# EAGLE design io (EAGLE 9.6.2)
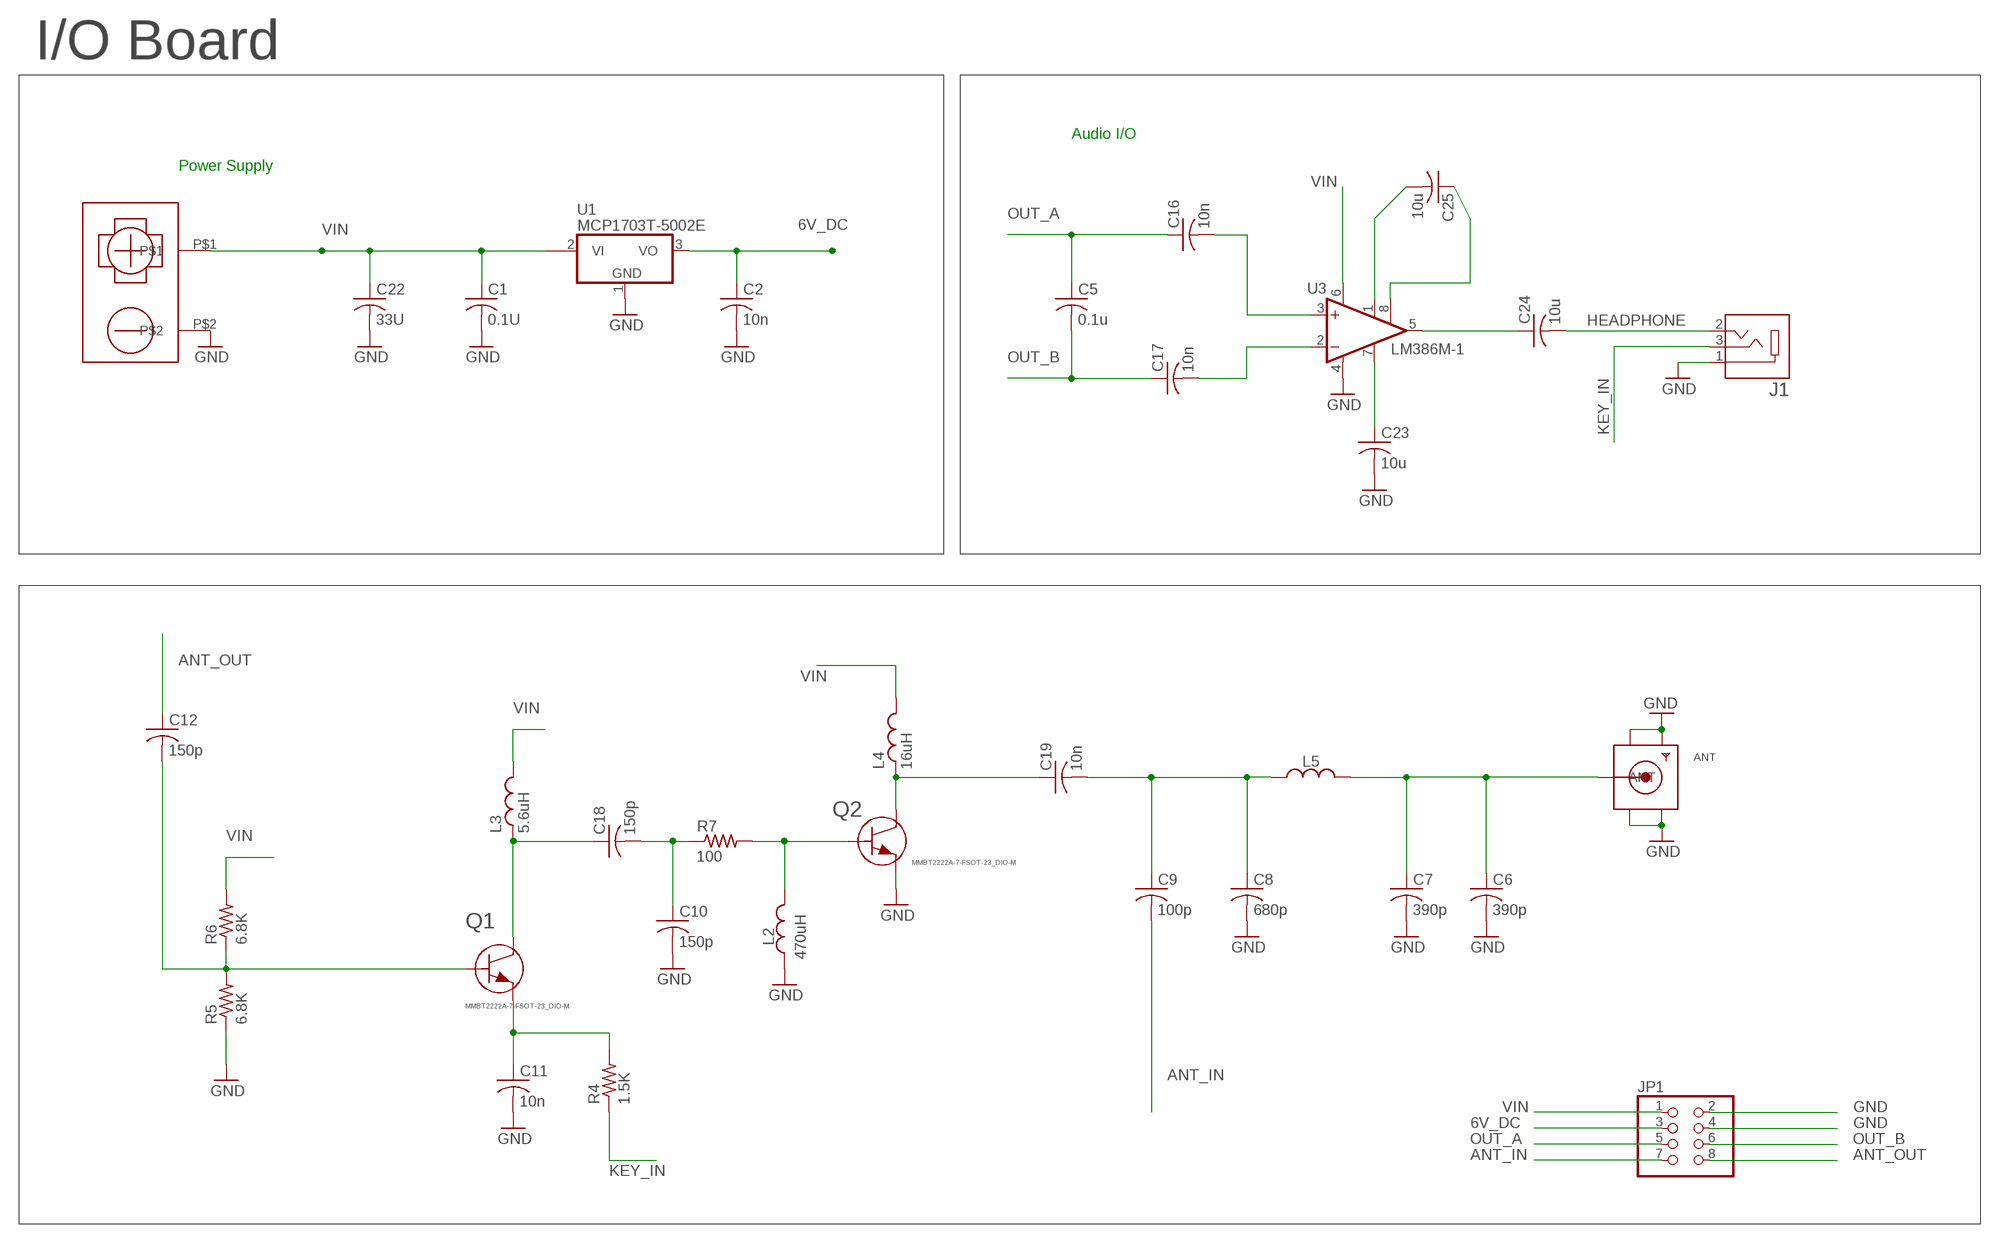
[diagram p0: schematic, sheet 1]

## Parts
ANT  SMACONNECTOR_EDGE  [SMA_EDGELAUNCH]
C1  0.1U  C-USC0805  [C0805]
C2  10n  C-USC0805  [C0805]
C5  0.1u  C-USC0805  [C0805]
C6  390p  C-USC0805  [C0805]
C7  390p  C-USC0805  [C0805]
C8  680p  C-USC0805  [C0805]
C9  100p  C-USC0805  [C0805]
C10  150p  C-USC0805  [C0805]
C11  10n  C-USC0805  [C0805]
C12  150p  C-USC0805  [C0805]
C16  10n  C-USC0805  [C0805]
C17  10n  C-USC0805  [C0805]
C18  150p  C-USC0805  [C0805]
C19  10n  C-USC1206  [C1206]
C22  33U  C-USC1206  [C1206]
C23  10u  C-USC0805  [C0805]
C24  10u  C-USC0805  [C0805]
C25  10u  C-USC0805  [C0805]
J1  SJ-3523-SMT-TR  [CUI_SJ-3523-SMT-TR]
JP1  PINHD-2X4  [2X04]
L2  470uH  L_CHIP-1008(2520-METRIC)  [INDC2520X120N]
L3  5.6uH  SRP3012C-5R6M  [SRP3012C]
L4  16uH  ASPI-0630LR  [ASPI-0630LR]
L5  1.2uH  SRN4018TA-1R2M  [SRN4018TA]
Q1  MMBT2222A-7-FSOT-23_DIO-M  [SOT-23_DIO-M]
Q2  MMBT2222A-7-FSOT-23_DIO-M  [SOT-23_DIO-M]
R4  1.5K  R-US_M0805  [M0805]
R5  6.8K  R-US_M0805  [M0805]
R6  6.8K  R-US_M0805  [M0805]
R7  100  R-US_M0805  [M0805]
U1  MCP1703T-5002E  MCP170312MB  [SOT89]
U3  LM386M-1  [SO08]
U$1  9V_9689V_968_SMD  [9V_968_PAD]

## Nets
6V_DC [power]: C2.1 JP1.3 U1.3(VO)
ANT_IN: C9.2 JP1.7
ANT_OUT: C12.1 JP1.8
GND: ANT.GND@1(GND4) ANT.GND@3(GND2) C1.2 C2.2 C6.2 C7.2 C8.2 C10.2 C11.2 C22.2 C23.2 J1.1 JP1.2 JP1.4 L2.1 R5.1 U1.1(GND) U3.4(GND) U$1.P$2
HEADPHONE: C24.2 J1.2
KEY_IN: J1.3 R4.1
N$1: ANT.GND@2(GND3)
N$2: ANT.GND@4(GND1)
N$9: C16.2 U3.3(+IN)
N$10: C17.2 U3.2(-IN)
N$11: C23.1 U3.7(BYPASS)
N$12: C25.1 U3.8(GAIN)
N$13: C25.2 U3.1(GAIN)
N$14: C24.1 U3.5(OUT)
N$19 [power]: C12.2 Q1.1 R5.2 R6.1
N$20 [power]: C11.1 Q1.2 R4.2
N$21 [power]: C18.1 L3.P$1 Q1.3
N$22 [power]: C10.1 C18.2 R7.1
N$23 [power]: L2.2 Q2.1 R7.2
N$24 [power]: C19.1 L4.P$1 Q2.3
N$25 [power]: C8.1 C9.1 C19.2 L5.P$1
N$26 [power]: ANT.P(ANT) C6.1 C7.1 L5.P$2
N$29 [power]: Q2.2 ; supply symbol labelled GND
OUT_A: C5.1 C16.1 JP1.5
OUT_B: C5.2 C17.1 JP1.6
VIN [power]: C1.1 C22.1 JP1.1 L3.P$2 L4.P$2 R6.2 U1.2@1(VI1) U3.6(VS) U$1.P$1
Unconnected: U1.2(VI)

## Notes on the sheet
- I/O Board
- Audio I/O
- Power Supply

## Library data of the parts
ANT = zort2:SMACONNECTOR: SMA Connector 90° DIP SMA Connector, 50 Ohm (4UConnector: 07259)
C1 C2 C5-C12 C16-C19 C22-C25 = adafruit:C-US: CAPACITOR, American symbol
J1 = SJ-3523-SMT-TR:SJ-3523-SMT-TR: Audio Jack Connector 3.5 mm Low Profile Surface Mount Stereo Jack, 3 Pin Right-Angle; MF: CUI Inc; STANDARD: Manufacturer recommendations
JP1 = adafruit:PINHD-2X4: PIN HEADER
L2 = zort2:L: Inductor Fixed - Generic; CATEGORY: Inductor; SUB-CATEGORY: Fixed
L3 = zort2:SRP3012C-5R6M: SRP3012C-5R6M SMD 1.5A 15uH inductor with a flat square package. DigiKey Link <https://www.digikey.com/en/products/detail/bourns-inc/SRP3012C-5R6M/11633310>.
L4 = zort2:ASPI-0630LR: ASPI-0630LR SMD inductors with flat square cases DigiKey Link <https://www.digikey.com/en/products/detail/abracon-llc/ASPI-0630LR-150M-T15/3059603>
L5 = zort2:SRN4018TA-1R2M: SRN4018TA-1R2M 1.2uH 3A inductor
Q1 Q2 = zort2:MMBT2222A-7-F; BUILT_BY: EMA_UL_Team; MANUFACTURER_PART_NUMBER: MMBT2222A-7-F; SOURCELIBRARY: DIODESINC_2_2015-08-18; VENDOR: Diodes Inc
R4-R7 = adafruit:R-US_: RESISTOR, American symbol
U1 = linear:MCP1703*: 250 mA, 16V, Low Quiescent Current LDO Regulator Source: http://ww1.microchip.com/downloads/en/DeviceDoc/22049b.pdf
U3 = linear:LM386?-*: Low Voltage Audio Power Amplifier Source: http://cache.national.com/ds/LM/LM386.pdf
U$1 = zort2:9V_968: Keystone 968, 9V connector pad. https://www.digikey.com/product-detail/en/keystone-electronics/968/36-968-ND/151577

## Net classes
1 power: width 0.381 mm

## Board
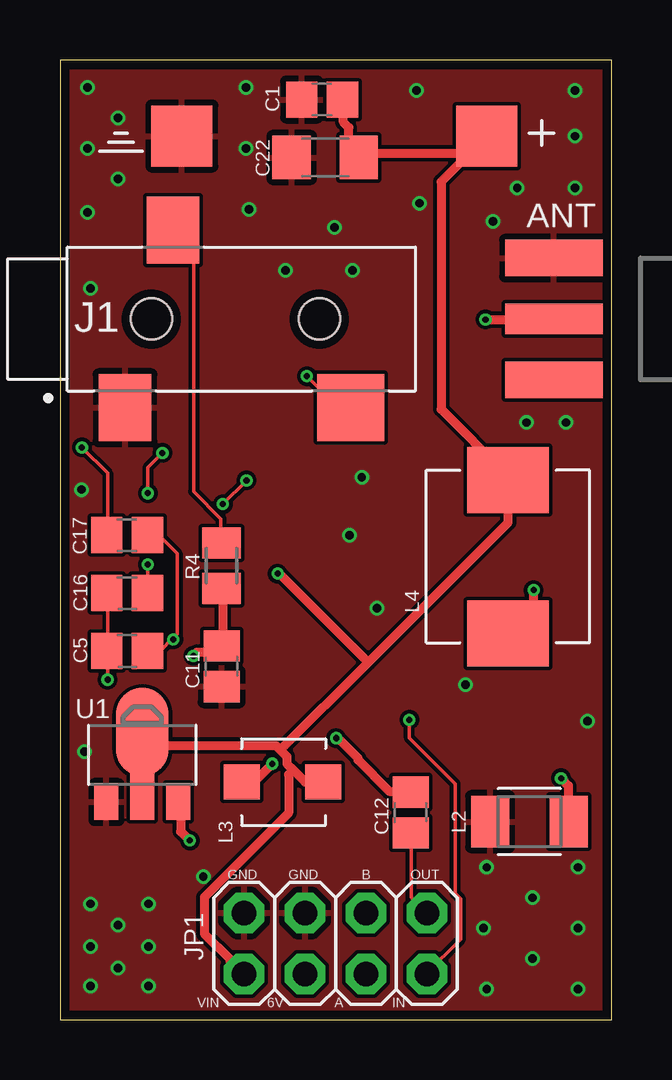
[diagram p1: board, top side]
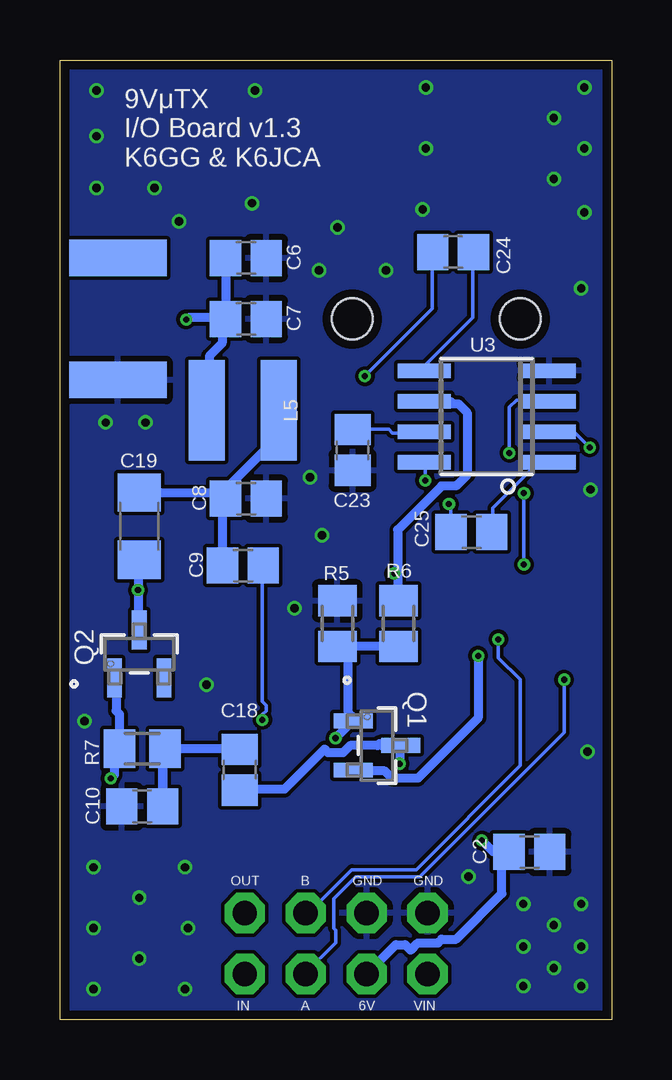
[diagram p2: board, bottom side, seen from below]

Size 22.99 x 40.01 mm. Coordinates in mm from the lower left corner, seen from the top.
Outline: 0,0 22.99,0 22.99,40.01 0,40.01 0,0
Copper layers (1*16): Top 0.035559375mm / dielectric 1.6mm / Bottom 0.035559375mm
Design rules "oshpark-2layer": minimum track width 6mil, minimum drill 10mil, track to track 6mil, track to pad 6mil, pad to pad 6mil, via to via 6mil, smd to smd 6mil, copper to edge 15mil, drill to drill 6mil, minimum pad ring 5mil, minimum via ring 5mil, stop-mask expansion 2.5mil, vias tented up to drill 0mil, thermal gap 10mil

### Footprints (pad centres in the part's own frame; a part is rotated, then mirrored left to right if it is on the bottom)
SMA_EDGELAUNCH = smd 4.064 x 1.524: GND@1 2.032,-2.54; GND@2 2.032,2.54 | smd 4.064 x 1.524 bottom: GND@3 2.032,2.54; GND@4 2.032,-2.54 | smd 4.064 x 1.27: P 2.032,0
C0805 = smd 1.3 x 1.5: 1 -0.85,0; 2 0.85,0
C1206 = smd 1.6 x 1.8: 1 -1.4,0; 2 1.4,0
CUI_SJ-3523-SMT-TR = smd 2.2 x 2.8: 1 -1.1,-3.7; 3 0.9,3.7 | smd 2.8 x 2.8: 2 8.3,-3.7 | hole 1.7: 0,0; 7,0
2X04 = drill 1.016 pad 1.676 octagon: 1 -3.81,-1.27; 2 -3.81,1.27; 3 -1.27,-1.27; 4 -1.27,1.27; 5 1.27,-1.27; 6 1.27,1.27; 7 3.81,-1.27; 8 3.81,1.27
INDC2520X120N = smd 1.587 x 2.129: 1 -1.633,0; 2 1.633,0
SRP3012C = smd 1.5 x 1.45: P$1 -1.7,0; P$2 1.7,0
ASPI-0630LR = smd 2.75 x 3.4: P$1 -3.2,0; P$2 3.2,0
SRN4018TA = smd 1.5 x 4.2: P$1 -1.5,0; P$2 1.5,0
SOT-23_DIO-M = smd 0.612 x 1.626: 1 -1.025,-0.996; 2 1.025,-0.996; 3 0,0.996
M0805 = smd 1.3 x 1.6: 1 -0.95,0; 2 0.95,0
SOT89 = smd 1 x 1.5: 1 -1.499,-1.981; 3 1.499,-1.981 | smd 1 x 2: 2 0,-1.727 | smd 2.2 x 3.7: 2@1 0,0.94
SO08 = smd 0.6 x 2.2: 1 -1.905,-2.6; 2 -0.635,-2.6; 3 0.635,-2.6; 4 1.905,-2.6; 5 1.905,2.6; 6 0.635,2.6; 7 -0.635,2.6; 8 -1.905,2.6
9V_968_PAD = smd 2.54 x 2.54: P$1 0,6.35; P$2 0,-6.35

### Placement (x,y rotation side)
ANT  22.61,29.21 180 top
C1  10.92,38.35 180 top
C2  3.43,6.99 0 bottom
C5  2.79,15.37 0 top
C6  15.24,31.75 0 bottom
C7  15.24,29.21 0 bottom
C8  15.24,21.72 0 bottom
C9  15.37,18.92 0 bottom
C10  19.56,8.89 180 bottom
C11  6.73,14.73 270 top
C12  14.61,8.64 90 top
C16  2.79,17.78 0 top
C17  2.79,20.19 180 top
C18  15.49,10.41 90 bottom
C19  19.68,20.57 90 bottom
C22  11.05,35.94 180 top
C23  10.79,23.75 270 bottom
C24  6.6,32 180 bottom
C25  5.84,20.32 0 bottom
J1  3.81,29.21 0 top
JP1  11.48,3.17 0 top
L2  19.56,8.26 0 top
L3  9.27,9.91 0 top
L4  18.67,19.3 90 top
L5  15.37,25.4 180 bottom
Q1  9.78,11.43 270 bottom
Q2  19.68,15.24 0 bottom
R4  6.73,18.92 270 top
R5  11.43,16.51 270 bottom
R6  8.89,16.51 90 bottom
R7  19.56,11.3 180 bottom
U1  3.43,11.05 0 top
U3  5.21,25.15 90 bottom
U$1  11.43,36.83 270 top

### Tracks (layer width: path | path; a pad name or v marks a point on that pad's centre or on a via)
6V_DC  (via drill 0.25)
  Top 0.381: 4.88,8.76 4.88,9.07 U1.3 4.95,8.69 5.03,8.61 5.03,7.85 v5.41,7.47
  Bottom 0.381: v5.41,7.47 4.95,7.01 4.34,7.01 C2.1 4.57,6.86 4.57,5.26 6.48,3.35 7.09,3.35 7.24,3.2 8.08,3.2 8.38,2.9 8.61,3.12 8.99,3.12 JP1.3
ANT_IN  (via drill 0.25)
  Top 0.152: v14.55,12.5 14.55,11.73 16.46,9.83 16.46,5.26 16.69,5.03 16.69,3.35 15.24,1.91 JP1.7
  Bottom 0.152: 15.24,1.91 JP1.7 | v14.55,12.5 14.55,12.72 14.4,12.88 14.4,13.11 14.55,13.26 14.55,18.9 C9.2
ANT_OUT
  Top 0.152: JP1.8 14.63,5.11 14.63,7.77 C12.1
GND  (via drill 0.35)
  other vias: 1.14,38.86 7.75,38.86 1.14,36.32 7.75,36.32 14.86,38.73 21.46,38.73 21.46,34.67 1.27,4.83 3.68,4.83 1.27,1.4 3.68,1.4 17.78,6.35 21.59,6.35 17.78,1.27 21.59,1.27 12.06,20.19 13.21,17.14 16.89,13.97 21.97,12.45 1.27,30.48 11.43,33.02 1.02,11.18 0.89,22.1 5.97,5.97 18.03,33.27 19.43,24.89 21.08,24.89 1.14,33.66 7.87,33.78 14.99,34.04 21.46,36.83 19.05,34.67 12.57,22.61 2.41,3.94 1.27,3.05 2.41,2.16 3.68,3.05 19.68,5.08 17.65,3.81 19.68,2.54 21.59,3.81 2.41,37.59 2.41,35.05 9.4,31.24 12.19,31.24
  pour Top: 0.38,39.75 0.38,0.38 22.73,0.38 22.73,39.62 22.73,39.75
  pour Bottom: 0.38,39.62 0.38,0.38 22.61,0.38 22.61,39.62
HEADPHONE  (via drill 0.25)
  Top 0.152: v10.29,26.82 11.58,25.53 12.04,25.53 J1.2
  Bottom 0.152: v10.29,26.82 7.47,29.64 7.47,32 C24.2
KEY_IN
  Top 0.152: R4.1 6.71,19.89 6.71,20.88 5.56,22.02 5.56,32 4.72,32.84 J1.3
N$9  (via drill 0.25)
  Top 0.152: v3.66,18.97 3.66,17.83 C16.2 | v3.66,21.95 3.66,23.01 v4.27,23.62
  Bottom 0.152: v3.66,21.95 v3.66,18.97 | v4.27,23.62 4.27,25.53 3.96,25.83 2.67,25.83 U3.3
N$10  (via drill 0.25)
  Top 0.152: v0.91,23.85 1.98,22.78 1.98,20.19 C17.2
  Bottom 0.152: v0.91,23.85 1.52,24.46 2.59,24.46 U3.2
N$11
  Bottom 0.152: C23.1 10.74,24.61 9.3,24.61 9.14,24.46 7.85,24.46 U3.7
N$12  (via drill 0.25)
  Top 0.152: v7.77,22.48 v6.78,21.49
  Bottom 0.152: 7.7,23.16 7.77,23.24 U3.8 7.77,23.16 v7.77,22.48 | 6.71,20.34 C25.1 6.71,20.42 6.71,21.41 v6.78,21.49
N$13
  Bottom 0.152: U3.1 3.05,23.24 4.95,21.34 4.95,20.34 C25.2
N$14
  Bottom 0.152: C24.1 5.79,32 5.79,29.26 7.85,27.2 7.85,27.05 U3.5
N$19  (via drill 0.25)
  Top 0.381: v11.51,11.73 11.58,11.73 12.42,10.9 12.42,10.82 13.72,9.53 14.55,9.53 C12.2
  Bottom 0.381: v11.51,11.73 10.82,12.42 Q1.1 10.82,12.65 10.97,12.8 10.97,15.39 10.9,15.54 R5.2 R6.1
N$20  (via drill 0.25)
  Top 0.381: R4.2 6.78,17.91 6.78,15.62 C11.1 6.55,15.54 6.33,15.32 5.71,15.32 v5.56,15.16
  Bottom 0.381: v5.56,15.16 5.56,12.57 8.08,10.06 9.14,10.06 9.45,10.36 10.74,10.36 Q1.2
N$21  (via drill 0.25)
  Top 0.381: 7.44,10.03 L3.P$1 7.7,9.98 8.15,9.98 v8.84,10.67
  Bottom 0.381: C18.1 15.47,9.6 13.64,9.6 11.96,11.28 11.81,11.12 11.2,11.12 10.9,11.43 9.75,11.43 9.68,11.51 9.6,11.43 Q1.3 8.84,11.28 v8.84,10.67
N$22
  Bottom 0.381: 18.52,11.28 15.54,11.28 C18.2 | 18.59,11.28 18.71,11.16 C10.1 18.71,11.2 R7.1
  Bottom 0.762: 18.59,11.28 18.52,11.28
N$23  (via drill 0.25)
  Top 0.381: v20.88,10.06 21.18,9.75 21.18,8.31 L2.2
  Bottom 0.381: 20.5,11.51 20.5,12.72 20.65,12.88 20.65,14.17 Q2.1 | v20.88,10.06 20.73,10.21 20.73,10.97 20.57,11.12 20.57,11.24 R7.2 20.5,11.31
  Bottom 0.762: 20.5,11.31 20.5,11.51
N$24  (via drill 0.25)
  Top 0.381: v19.74,17.91 19.74,17.22 18.67,16.15 L4.P$1
  Bottom 0.381: Q2.3 19.74,16.31 v19.74,17.91 19.74,19.13 C19.1
N$25
  Bottom 0.381: 19.66,21.95 C19.2 19.51,21.95 16.46,21.95 16.28,21.77 C8.1 | C9.1 16.23,18.97 16.23,21.49 16.09,21.58 C8.1 | C8.1 16.09,21.97 16.16,22.04 13.87,24.33 13.87,25.38 L5.P$1
N$26  (via drill 0.25)
  Top 0.381: v17.73,29.18 20.57,29.18 ANT.P
  Bottom 0.381: C7.1 16.08,29.26 16.08,31.7 C6.1 | 16.15,29.03 C7.1 | 16.84,25.45 L5.P$2 16.76,25.6 16.76,27.66 16.23,28.19 16.23,28.88 C7.1 | v17.73,29.18 17.65,29.26 16.23,29.26 C7.1
OUT_A  (via drill 0.25)
  Top 0.152: C16.1 1.98,17.75 1.98,15.39 C5.1 1.98,15.32 v1.98,14.17
  Bottom 0.152: v1.98,14.17 1.98,11.96 8,5.94 10.67,5.94 11.58,5.03 11.58,3.81 11.51,3.73 11.51,3.2 12.8,1.91 JP1.5
OUT_B  (via drill 0.25)
  Top 0.152: 4.69,15.89 4.88,16.08 4.88,19.43 4.12,20.19 C17.1 | 4.69,15.89 4.19,15.39 3.66,15.39 C5.2 | v4.72,15.85 4.69,15.89
  Bottom 0.152: v4.72,15.85 4.72,15.09 3.81,14.17 3.81,10.59 8.15,6.25 10.82,6.25 12.57,4.5 12.72,4.5 JP1.6
VIN  (via drill 0.25)
  Top 0.381: C1.1 11.81,38.33 11.81,37.41 12.04,37.19 12.04,36.35 12.42,35.97 C22.1 12.5,36.12 16.54,36.12 U$1.P$1 15.88,34.92 15.88,25.45 18.59,22.73 | L3.P$2 10.21,9.91 9.72,10.4 | 9.72,10.4 9.45,10.67 9.45,10.97 9.18,11.24 | 9.18,11.24 8.99,11.43 3.96,11.43 3.43,11.96 U1.2@1 | JP1.1 7.62,1.91 7.09,2.44 7.09,2.52 6.02,3.58 6.02,5.11 9.53,8.61 9.53,10.21 9.72,10.4 | 9.18,11.24 12.84,14.9 | 12.84,14.9 18.67,20.73 L4.P$2 18.59,22.63 18.59,22.73 | 18.59,22.73 18.59,23.01 | v9.07,18.59 9.14,18.59 12.84,14.9
  Top 0.762: 16.89,35.94 U$1.P$1
  Bottom 0.381: 7.77,25.83 U3.6 7.7,25.76 6.71,25.76 6.63,25.68 6.4,25.68 6.02,25.3 6.02,22.71 6.48,22.25 7.09,22.25 8.91,20.42 8.91,18.59 | 8.91,18.59 8.91,17.53 R6.2 | v9.07,18.59 8.91,18.59

### Text on the board
tNames: GND | GND | B | OUT | VIN | 6V | A | IN
bNames: 9VμTX / I/O Board v1.3 / K6GG & K6JCA | GND | GND | B | OUT | VIN | 6V | A | IN